# EAGLE design icd3-icsp-adapter (EAGLE 5.10)
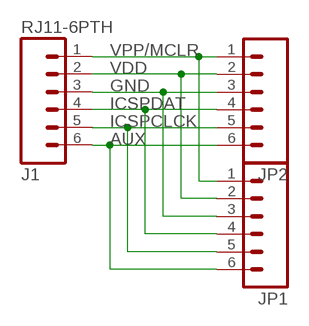
[diagram p0: schematic, sheet 1]

## Parts
J1  RJ11-6PTH  [RJ11-6]
JP1  M06LOCK_LONGPADS  [1X06_LOCK_LONGPADS]
JP2  M06LOCK_LONGPADS  [1X06_LOCK_LONGPADS]

## Nets
AUX: J1.6 JP1.6 JP2.6
GND: J1.3 JP1.3 JP2.3
ICSPCLCK: J1.5 JP1.5 JP2.5
ICSPDAT: J1.4 JP1.4 JP2.4
VDD: J1.2 JP1.2 JP2.2
VPP/MCLR: J1.1 JP1.1 JP2.1

## Library data of the parts
J1 = SparkFun:RJ11-6: RJ11 Jack Simple 6 pin RJ11 jack. Commonly found on CAT3 devices and Microchip programmers. SKU: PRT-00132
JP1 JP2 = SparkFun:M06: Header 6 Standard 6-pin 0.1" header. Use with straight break away headers (SKU : PRT-00116), right angle break away headers (PRT-00553), swiss pins (PRT-00743), machine pins (PRT-00117), and female headers (PRT-00115). Molex polarized connector foot print use with SKU : PRT-08094 with associated crimp pins and housings. NOTES ON THE VARIANTS LOCK and LOCK_LONGPADS... This footprint was designed to help hold the alignment of a through-hole component (i.e. 6-pin header) while soldering it into place. You may notice that each hole has been shifted either up or down by 0.005 of an inch from it's more standard position (which is a perfectly straight line). This slight alteration caused the pins (the squares in the middle) to touch the edges of the holes. Because they are alternating, it causes a "brace" to hold the component in place. 0.005 has proven to be the perfect amount of "off-center" position when using our standard breakaway headers. Although looks a little odd when you look at the bare footprint, once you have a header in there, the alteration is very hard to notice. Also, if you push a header all the way into place, it is covered up entirely on the bottom side. This idea of altering the position of holes to aid alignment will be further integrated into the Sparkfun Library for other footprints. It can help hold any component with 3 or more connection pins.

## Board
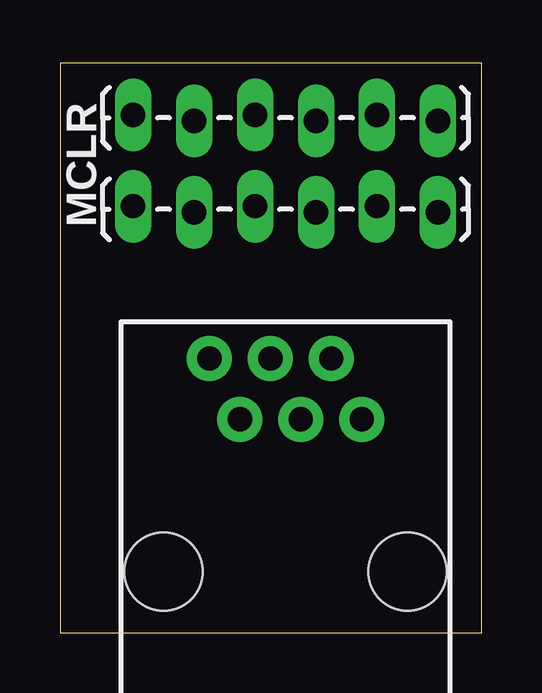
[diagram p1: board, top side]
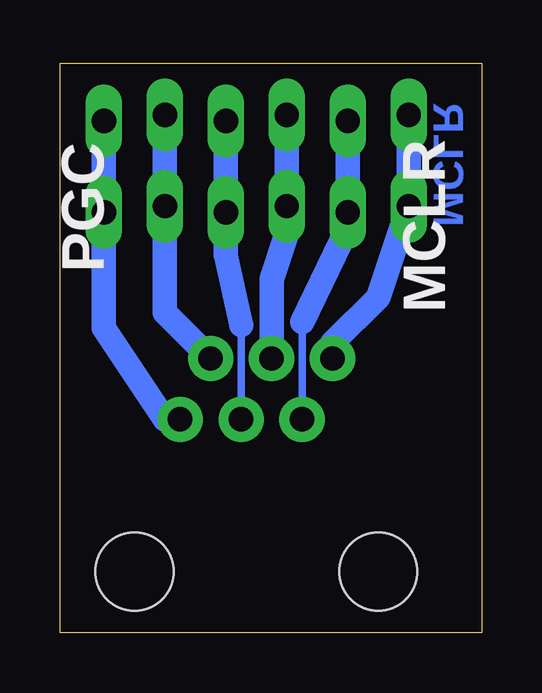
[diagram p2: board, bottom side, seen from below]

Size 17.58 x 23.74 mm. Coordinates in mm from the lower left corner, seen from the top.
Outline: 0,0 17.58,0 17.58,23.74 0,23.74 0,0
Copper layers (1*16): Top 0.035mm / dielectric 1.5mm / Bottom 0.035mm
Design rules "toner-transfer-flexible *": minimum track width 0.8mm, minimum drill 0.8mm, track to track 0.8mm, track to pad 0.8mm, pad to pad 0.8mm, via to via 0.8mm, smd to smd 8mil, copper to edge 10mil, drill to drill 8mil, minimum pad ring 10mil, minimum via ring 8mil, stop-mask expansion 4mil, vias tented up to drill 0mil, thermal gap 10mil

### Footprints (pad centres in the part's own frame; a part is rotated, then mirrored left to right if it is on the bottom)
RJ11-6 = drill 1.016 pad 1.88 round: 1 1.905,8.89; 2 3.175,6.35; 3 4.445,8.89; 4 5.715,6.35; 5 6.985,8.89; 6 8.255,6.35 | hole 3.251: 0,0; 10.16,0
1X06_LOCK_LONGPADS = drill 1.016 long: 1 0,0; 2 2.54,-0.254; 3 5.08,0; 4 7.62,-0.254; 5 10.16,0; 6 12.7,-0.254

### Placement (x,y rotation side)
J1  4.32,2.54 0 top
JP1  3.05,21.59 0 top
JP2  3.05,17.78 0 top

### Tracks (layer width: path | path; a pad name or v marks a point on that pad's centre or on a via)
AUX
  Bottom 1.016: J1.6 13.21,8.89 15.75,12.7 JP2.6 JP1.6
GND
  Bottom 1.016: J1.3 8.76,14.73 8.13,16.64 JP2.3 JP1.3
ICSPCLCK
  Bottom 1.016: J1.5 13.21,13.33 JP2.5 JP1.5
ICSPDAT
  Bottom 0.305: J1.4 10.03,12.83
  Bottom 1.016: 10.03,12.83 10.67,15.75 JP2.4 JP1.4
VDD
  Bottom 0.305: J1.2 7.49,12.95
  Bottom 1.016: 7.49,12.95 5.59,16.89 JP2.2 JP1.2
VPP/MCLR
  Bottom 1.016: J1.1 6.22,12.06 4.32,13.97 JP2.1 JP1.1

### Text on the board
Bottom: MCLR
tNames: MCLR
bNames: MCLR | PGC